# EAGLE schematic TCC_COMPLETO-1 (EAGLE 4.16)
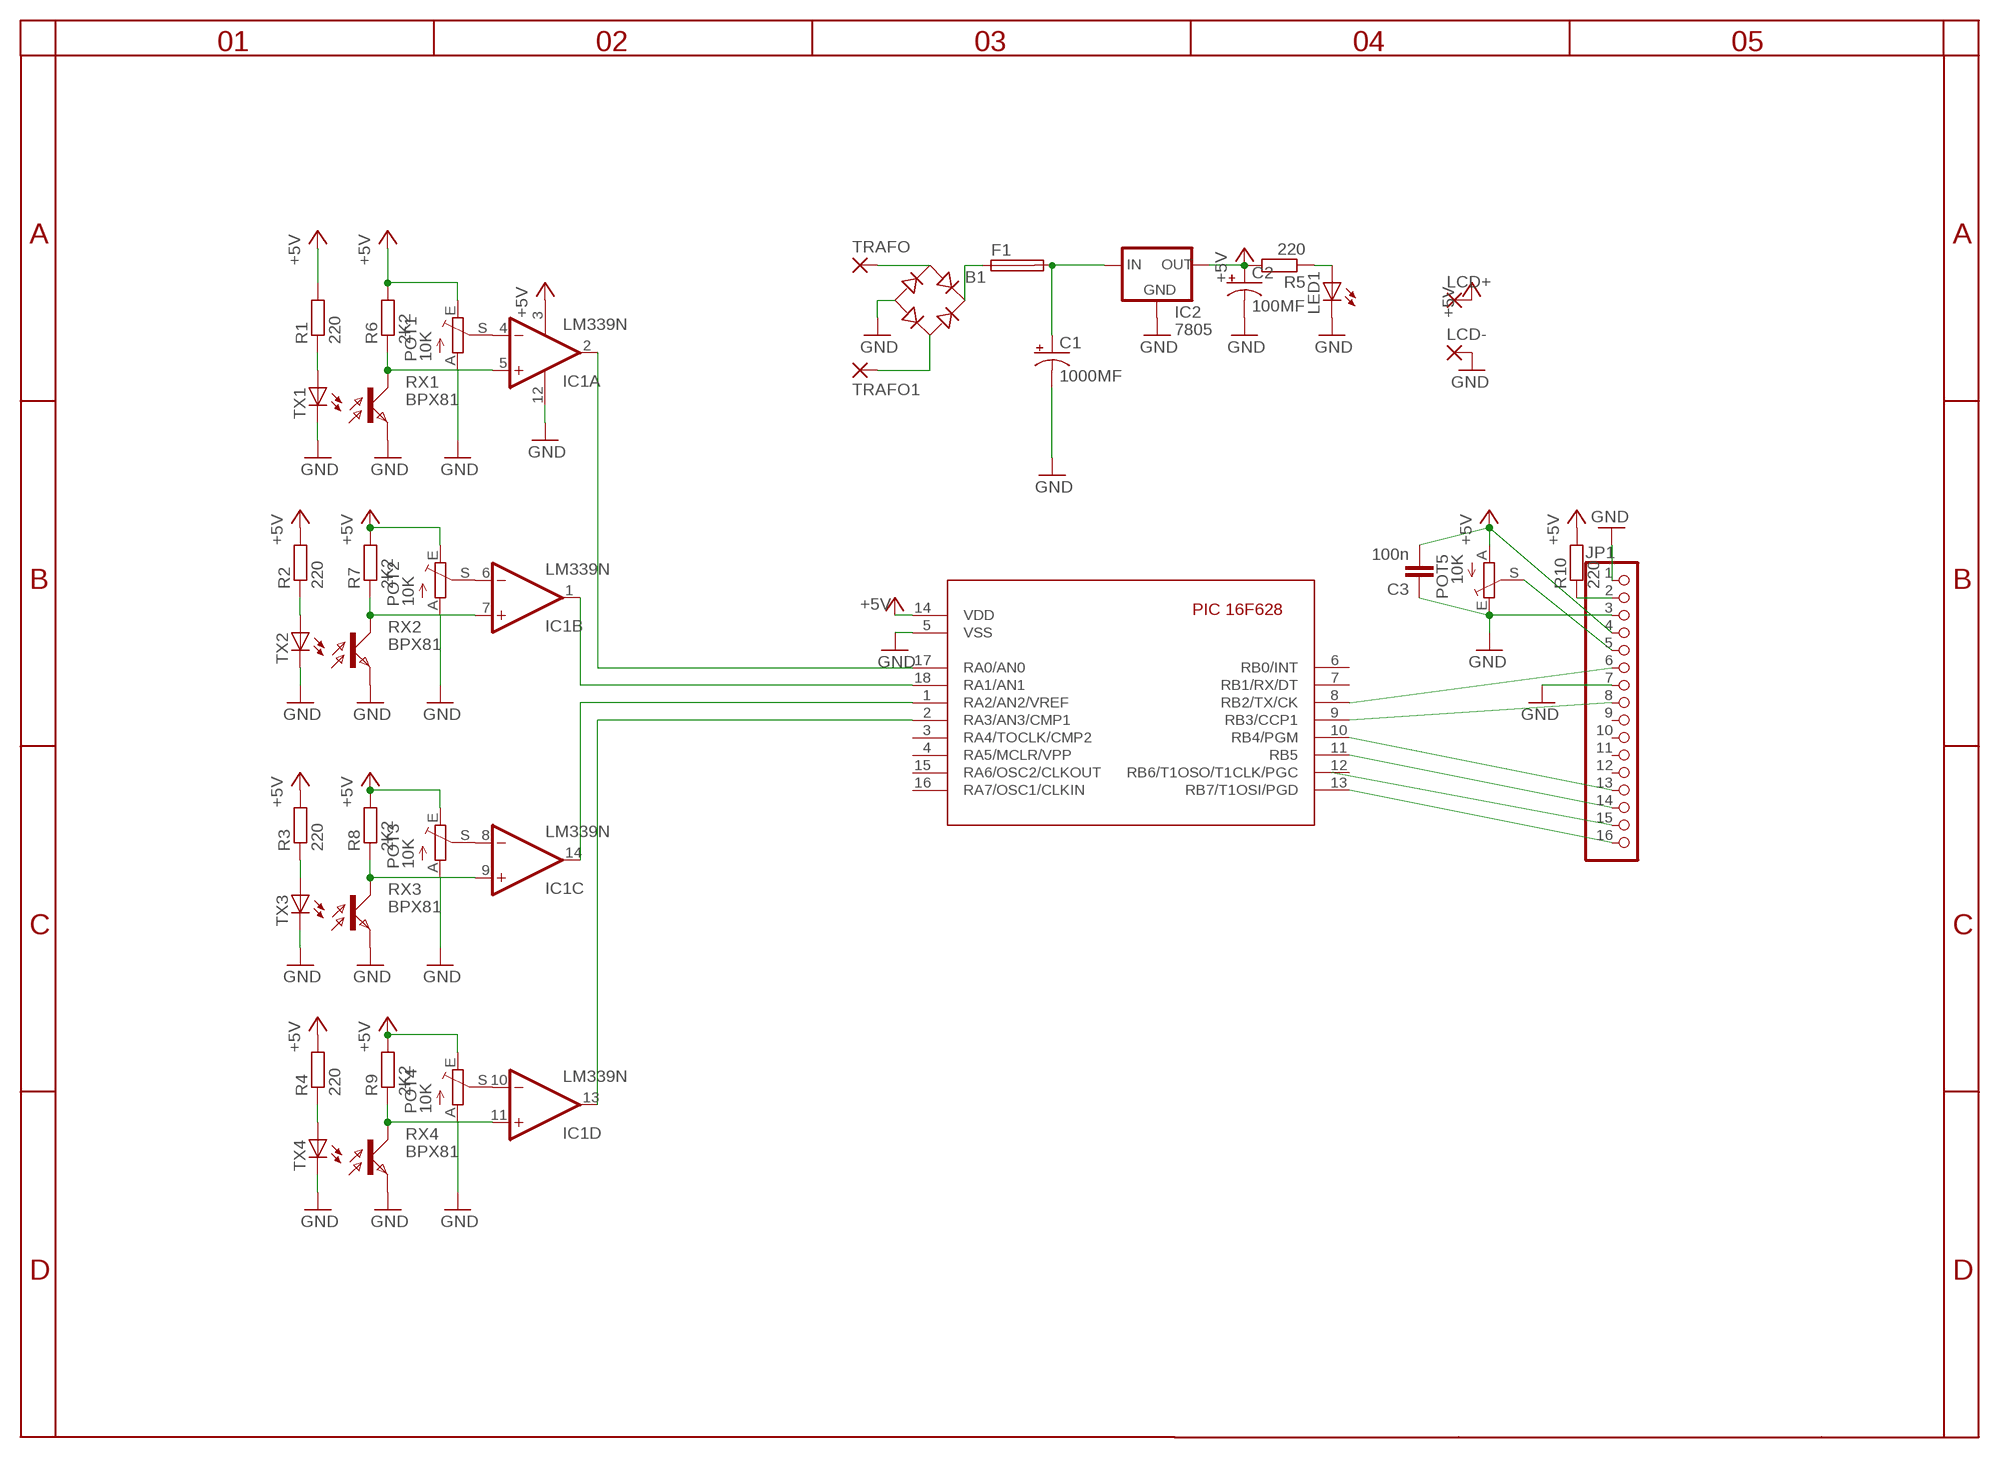
[diagram p0: schematic, sheet 1]

## Parts
B1  RB1A  [RB1A]
C1  1000MF  CPOL-USE5-10.5  [E5-10,5]
C2  100MF  CPOL-USE5-8.5  [E5-8,5]
C3  100n  CYYC7B5  [YC7B5]
F1  SH22,5  [SH22,5]
IC1  LM339N  [DIL14]
IC2  7805  78XXS  [78XXS]
JP1  PINHD-1X16  [1X16]
LCD+  2,54/1,0  [2,54/1,0]
LCD-  2,54/1,0  [2,54/1,0]
LED1  LED5MM  [LED5MM]
POT1  10K  TRIM_EU-LI10  [LI10]
POT2  10K  TRIM_EU-LI10  [LI10]
POT3  10K  TRIM_EU-LI10  [LI10]
POT4  10K  TRIM_EU-LI10  [LI10]
POT5  10K  TRIM_EU-LI10  [LI10]
R1  220  R-EU_0207/10  [0207/10]
R2  220  R-EU_0207/10  [0207/10]
R3  220  R-EU_0207/10  [0207/10]
R4  220  R-EU_0207/10  [0207/10]
R5  220  R-EU_0207/10  [0207/10]
R6  2K2  R-EU_0207/10  [0207/10]
R7  2K2  R-EU_0207/10  [0207/10]
R8  2K2  R-EU_0207/10  [0207/10]
R9  2K2  R-EU_0207/10  [0207/10]
R10  220  R-EU_0207/10  [0207/10]
RX1  BPX81  [BPX81]
RX2  BPX81  [BPX81]
RX3  BPX81  [BPX81]
RX4  BPX81  [BPX81]
TRAFO  2,54/1,0  [2,54/1,0]
TRAFO1  2,54/1,0  [2,54/1,0]
TX1  LED5MM  [LED5MM]
TX2  LED5MM  [LED5MM]
TX3  LED5MM  [LED5MM]
TX4  LED5MM  [LED5MM]
U$1  16F628  [PIC16F628-18-LEAD-PDIP]

## Nets
+5V: C2.+ C3.2 IC1.3(P:V+) IC2.OUT JP1.4 LCD+.1(P) POT1.E POT2.E POT3.E POT4.E POT5.A R1.2 R2.2 R3.2 R4.2 R5.2 R6.2 R7.2 R8.2 R9.2 R10.2 U$1.14(VDD)
GND: B1.- C1.- C2.- C3.1 IC1.12(P:GND) IC2.GND JP1.1 JP1.3 JP1.7 LCD-.1(P) LED1.K(C) POT1.A POT2.A POT3.A POT4.A POT5.E RX1.E RX2.E RX3.E RX4.E TX1.K(C) TX2.K(C) TX3.K(C) TX4.K(C) U$1.5(VSS)
N$1: JP1.6 U$1.8(RB2/TX/CK)
N$2: JP1.8 U$1.9(RB3/CCP1)
N$3: JP1.16 U$1.13(RB7/T1OSI/PGD)
N$4: JP1.15
N$5: JP1.14 U$1.11(RB5)
N$6: JP1.13 U$1.10(RB4/PGM)
N$8: LED1.A R5.1
N$9: JP1.2 R10.1
N$10: JP1.5 POT5.S
N$11: IC1.9(C:+IN) R8.1 RX3.C
N$12: IC1.4(A:-IN) POT1.S
N$13: IC1.6(B:-IN) POT2.S
N$14: IC1.8(C:-IN) POT3.S
N$15: IC1.10(D:-IN) POT4.S
N$18: R1.1 TX1.A
N$19: R2.1 TX2.A
N$20: R3.1 TX3.A
N$21: R4.1 TX4.A
N$22: IC1.5(A:+IN) R6.1 RX1.C
N$24: IC1.11(D:+IN) R9.1 RX4.C
N$26: IC1.2(A:OUT) U$1.17(RA0/AN0)
N$27: B1.AC1 TRAFO.1(P)
N$28: C1.+ F1.2 IC2.IN
N$29: B1.AC2 TRAFO1.1(P)
N$30: B1.+ F1.1
N$31: IC1.1(B:OUT) U$1.18(RA1/AN1)
N$32: IC1.14(C:OUT) U$1.1(RA2/AN2/VREF)
N$33: IC1.13(D:OUT) U$1.2(RA3/AN3/CMP1)
N$34: IC1.7(B:+IN) R7.1 RX2.C
Unconnected: JP1.9 JP1.10 JP1.11 JP1.12 U$1.3(RA4/TOCLK/CMP2) U$1.4(RA5/MCLR/VPP) U$1.6(RB0/INT) U$1.7(RB1/RX/DT) U$1.12(RB6/T1OSO/T1CLK/PGC) U$1.15(RA6/OSC2/CLKOUT) U$1.16(RA7/OSC1/CLKIN)

## Library data of the parts
B1 = rectifier:RB1A: RECTIFIER 1 A
C1 C2 = rcl:CPOL-US: POLARIZED CAPACITOR, American symbol
C3 = rcl:CY: Y CAPACITOR for power line
F1 = fuse:SH22,5: FUSE HOLDER grid 22,5 mm, OGN0031 8201, Schurter (Buerklin)
IC1 = linear:LM339: Low Power Low Offset Voltage Quad Comparators with open collector; LM139/LM239/LM339/LM2901/LM3302
IC2 = v-reg:78XXS: VOLTAGE REGULATOR
JP1 = pinhead:PINHD-1X16: PIN HEADER
LCD+ LCD- TRAFO TRAFO1 = wirepad:2,54/1,0: THROUGH-HOLE PAD
LED1 TX1-TX4 = led:LED: LED OSRAM: - CHIPLED LG R971, LG N971, LY N971, LG Q971, LY Q971, LO R971, LY R971 LH N974, LH R974 LS Q976, LO Q976, LY Q976 LO Q996 - Hyper CHIPLED LW Q18S LB Q993, LB Q99A, LB R99A - SideLED LS A670, LO A670, LY A670, LG A670, LP A670 LB A673, LV A673, LT A673, LW A673 LH A674 LY A675 LS A676, LA A676, LO A676, LY A676, LW A676 LS A679, LY A679, LG A679 - Hyper Micro SIDELED® LS Y876, LA Y876, LO Y876, LY Y876 LT Y87S - SmartLED LW L88C, LW L88S LB L89C, LB L89S, LG L890 LS L89K, LO L89K, LY L89K LS L896, LA L896, LO L896, LY L896 - TOPLED LS T670, LO T670, LY T670, LG T670, LP T670 LSG T670, LSP T670, LSY T670, LOP T670, LYG T670 LG T671, LOG T671, LSG T671 LB T673, LV T673, LT T673, LW T673 LH T674 LS T676, LA T676, LO T676, LY T676, LB T676, LH T676, LSB T676, LW T676 LB T67C, LV T67C, LT T67C, LS T67K, LO T67K, LY T67K, LW E67C LS E67B, LA E67B, LO E67B, LY E67B, LB E67C, LV E67C, LT E67C LW T67C LS T679, LY T679, LG T679 LS T770, LO T770, LY T770, LG T770, LP T770 LB T773, LV T773, LT T773, LW T773 LH T774 LS E675, LA E675, LY E675, LS T675 LS T776, LA T776, LO T776, LY T776, LB T776 LHGB T686 LT T68C, LB T68C - Hyper Mini TOPLED® LB M676 - Mini TOPLED Santana® LG M470 LS M47K, LO M47K, LY M47K Source: http://www.osram.convergy.de - LUMILED® LXK2-PW12-R00, LXK2-PW12-S00, LXK2-PW14-U00, LXK2-PW14-V00 LXK2-PM12-R00, LXK2-PM12-S00, LXK2-PM14-U00 LXK2-PE12-Q00, LXK2-PE12-R00, LXK2-PE12-S00, LXK2-PE14-T00, LXK2-PE14-U00 LXK2-PB12-K00, LXK2-PB12-L00, LXK2-PB12-M00, LXK2-PB14-N00, LXK2-PB14-P00, LXK2-PB14-Q00 LXK2-PR12-L00, LXK2-PR12-M00, LXK2-PR14-Q00, LXK2-PR14-R00 LXK2-PD12-Q00, LXK2-PD12-R00, LXK2-PD12-S00 LXK2-PH12-R00, LXK2-PH12-S00 LXK2-PL12-P00, LXK2-PL12-Q00, LXK2-PL12-R00 Source: www.luxeon.com
POT1-POT5 = pot:TRIM_EU-: POTENTIOMETER
R1-R10 = rcl:R-EU_: RESISTOR, European symbol
RX1-RX4 = opto-trans-siemens:BPX81: PHOTO TRANSISTOR
U$1 = pic16f6xx-1:16F628: Microchip component PIC 16F628 Eric Magraner - eric_magraner@yahoo.fr 03/2004